# Altium schematic sheet TMS320F28379D_TRIP.SchDoc
size A4
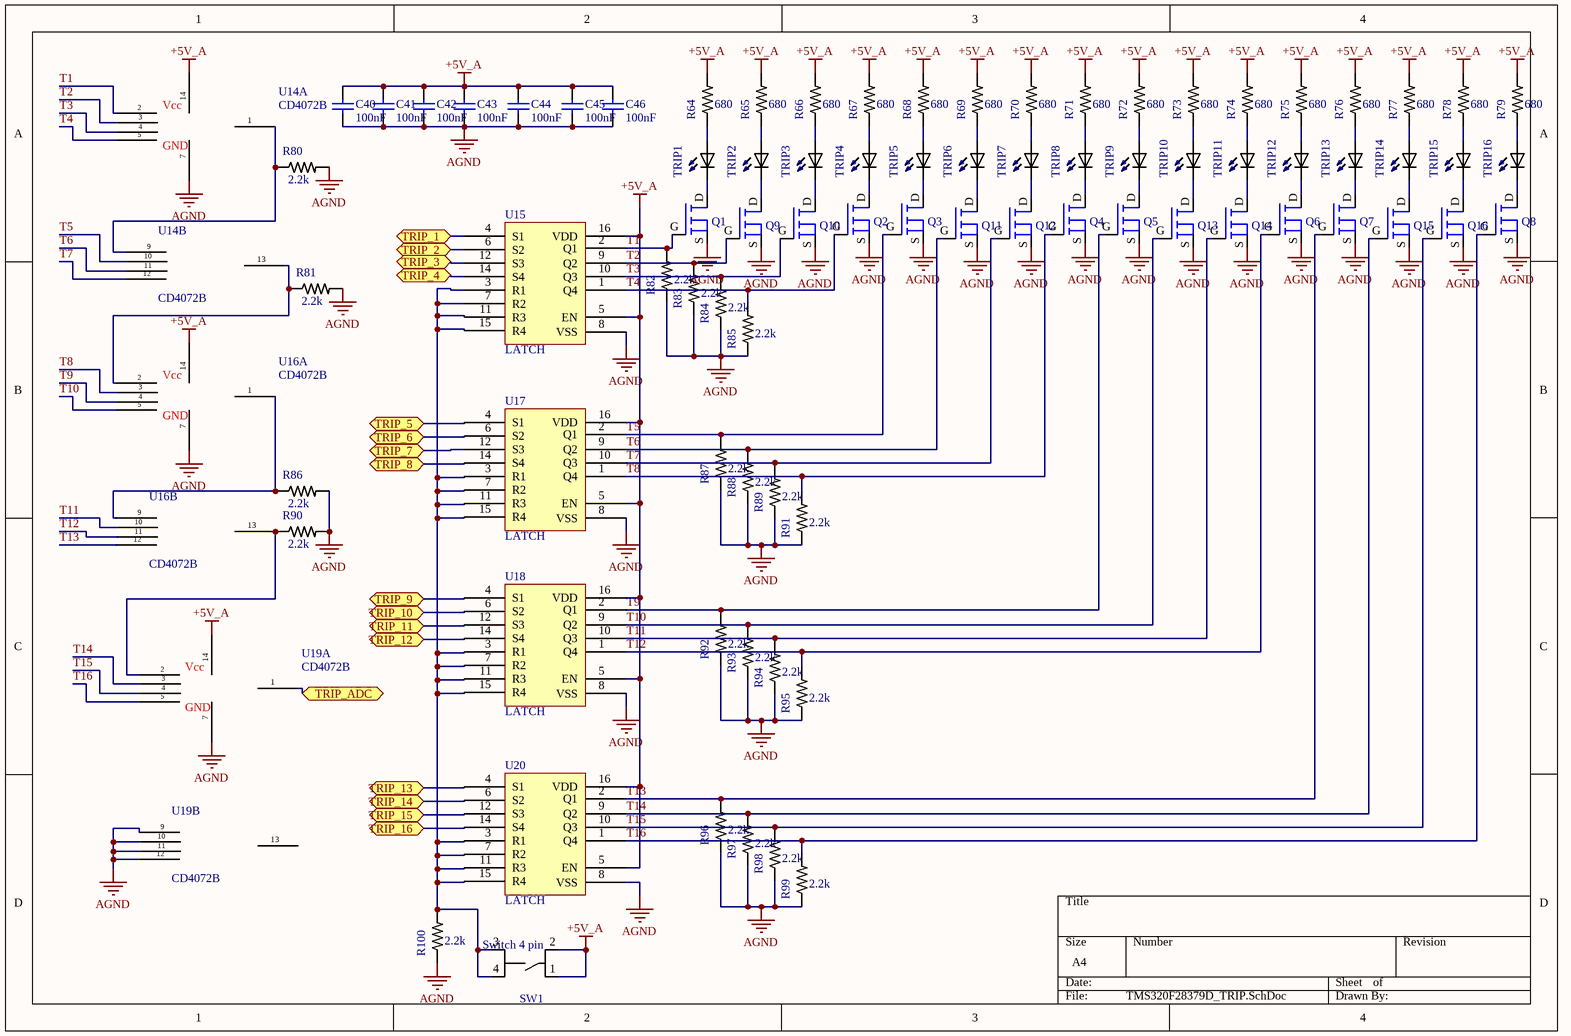
[diagram p0: TMS320F28379D_TRIP.SchDoc]

## Parts
C40  value 100nF  [CAP 0805]  (hidden comment: Cap cerámico)
C41  value 100nF  [CAP 0805]  (hidden comment: Cap cerámico)
C42  value 100nF  [CAP 0805]  (hidden comment: Cap cerámico)
C43  value 100nF  [CAP 0805]  (hidden comment: Cap cerámico)
C44  value 100nF  [CAP 0805]  (hidden comment: Cap cerámico)
C45  value 100nF  [CAP 0805]  (hidden comment: Cap cerámico)
C46  value 100nF  [CAP 0805]  (hidden comment: Cap cerámico)
Q1  MOSFET N  [SOT23]  (value not drawn)
Q2  MOSFET N  [SOT23]  (value not drawn)
Q3  MOSFET N  [SOT23]  (value not drawn)
Q4  MOSFET N  [SOT23]  (value not drawn)
Q5  MOSFET N  [SOT23]  (value not drawn)
Q6  MOSFET N  [SOT23]  (value not drawn)
Q7  MOSFET N  [SOT23]  (value not drawn)
Q8  MOSFET N  [SOT23]  (value not drawn)
Q9  MOSFET N  [SOT23]  (value not drawn)
Q10  MOSFET N  [SOT23]  (value not drawn)
Q11  MOSFET N  [SOT23]  (value not drawn)
Q12  MOSFET N  [SOT23]  (value not drawn)
Q13  MOSFET N  [SOT23]  (value not drawn)
Q14  MOSFET N  [SOT23]  (value not drawn)
Q15  MOSFET N  [SOT23]  (value not drawn)
Q16  MOSFET N  [SOT23]  (value not drawn)
R64  value 680  [Resistor 0805]  (hidden comment: Resistor 0805)
R65  value 680  [Resistor 0805]  (hidden comment: Resistor 0805)
R66  value 680  [Resistor 0805]  (hidden comment: Resistor 0805)
R67  value 680  [Resistor 0805]  (hidden comment: Resistor 0805)
R68  value 680  [Resistor 0805]  (hidden comment: Resistor 0805)
R69  value 680  [Resistor 0805]  (hidden comment: Resistor 0805)
R70  value 680  [Resistor 0805]  (hidden comment: Resistor 0805)
R71  value 680  [Resistor 0805]  (hidden comment: Resistor 0805)
R72  value 680  [Resistor 0805]  (hidden comment: Resistor 0805)
R73  value 680  [Resistor 0805]  (hidden comment: Resistor 0805)
R74  value 680  [Resistor 0805]  (hidden comment: Resistor 0805)
R75  value 680  [Resistor 0805]  (hidden comment: Resistor 0805)
R76  value 680  [Resistor 0805]  (hidden comment: Resistor 0805)
R77  value 680  [Resistor 0805]  (hidden comment: Resistor 0805)
R78  value 680  [Resistor 0805]  (hidden comment: Resistor 0805)
R79  value 680  [Resistor 0805]  (hidden comment: Resistor 0805)
R80  value 2.2k  [Resistor 0805]  (hidden comment: Resistor 0805)
R81  value 2.2k  [Resistor 0805]  (hidden comment: Resistor 0805)
R82  value 2.2k  [Resistor 0805]  (hidden comment: Resistor 0805)
R83  value 2.2k  [Resistor 0805]  (hidden comment: Resistor 0805)
R84  value 2.2k  [Resistor 0805]  (hidden comment: Resistor 0805)
R85  value 2.2k  [Resistor 0805]  (hidden comment: Resistor 0805)
R86  value 2.2k  [Resistor 0805]  (hidden comment: Resistor 0805)
R87  value 2.2k  [Resistor 0805]  (hidden comment: Resistor 0805)
R88  value 2.2k  [Resistor 0805]  (hidden comment: Resistor 0805)
R89  value 2.2k  [Resistor 0805]  (hidden comment: Resistor 0805)
R90  value 2.2k  [Resistor 0805]  (hidden comment: Resistor 0805)
R91  value 2.2k  [Resistor 0805]  (hidden comment: Resistor 0805)
R92  value 2.2k  [Resistor 0805]  (hidden comment: Resistor 0805)
R93  value 2.2k  [Resistor 0805]  (hidden comment: Resistor 0805)
R94  value 2.2k  [Resistor 0805]  (hidden comment: Resistor 0805)
R95  value 2.2k  [Resistor 0805]  (hidden comment: Resistor 0805)
R96  value 2.2k  [Resistor 0805]  (hidden comment: Resistor 0805)
R97  value 2.2k  [Resistor 0805]  (hidden comment: Resistor 0805)
R98  value 2.2k  [Resistor 0805]  (hidden comment: Resistor 0805)
R99  value 2.2k  [Resistor 0805]  (hidden comment: Resistor 0805)
R100  value 2.2k  [Resistor 0805]  (hidden comment: Resistor 0805)
SW1  Switch 4 pin  [Switch 4 pin]
TRIP1  LED  [LED_0805]  (value not drawn)
TRIP2  LED  [LED_0805]  (value not drawn)
TRIP3  LED  [LED_0805]  (value not drawn)
TRIP4  LED  [LED_0805]  (value not drawn)
TRIP5  LED  [LED_0805]  (value not drawn)
TRIP6  LED  [LED_0805]  (value not drawn)
TRIP7  LED  [LED_0805]  (value not drawn)
TRIP8  LED  [LED_0805]  (value not drawn)
TRIP9  LED  [LED_0805]  (value not drawn)
TRIP10  LED  [LED_0805]  (value not drawn)
TRIP11  LED  [LED_0805]  (value not drawn)
TRIP12  LED  [LED_0805]  (value not drawn)
TRIP13  LED  [LED_0805]  (value not drawn)
TRIP14  LED  [LED_0805]  (value not drawn)
TRIP15  LED  [LED_0805]  (value not drawn)
TRIP16  LED  [LED_0805]  (value not drawn)
U14  CD4072B  [14-TSSOP]  (parts A,B of 2)
U15  LATCH  [16-SOIC]
U16  CD4072B  [14-TSSOP]  (parts A,B of 2)
U17  LATCH  [16-SOIC]
U18  LATCH  [16-SOIC]
U19  CD4072B  [14-TSSOP]  (parts A,B of 2)
U20  LATCH  [16-SOIC]

## Ports
TRIP_1, TRIP_2, TRIP_3, TRIP_4, TRIP_5, TRIP_6, TRIP_7, TRIP_8, TRIP_9, TRIP_10, TRIP_11, TRIP_12, TRIP_13, TRIP_14, TRIP_15, TRIP_16, TRIP_ADC

## Nets
+5V_A: C40.1 C41.1 C42.1 C43.1 C44.1 C45.1 C46.1 R64.2 R65.2 R66.2 R67.2 R68.2 R69.2 R70.2 R71.2 R72.2 R73.2 R74.2 R75.2 R76.2 R77.2 R78.2 R79.2 SW1.1 SW1.2 U14.14 U15.5(EN) U15.16(VDD) U16.14 U17.5(EN) U17.16(VDD) U18.5(EN) U18.16(VDD) U19.14 U20.5(EN) U20.16(VDD)
AGND: C40.2 C41.2 C42.2 C43.2 C44.2 C45.2 C46.2 Q1.S Q2.S Q3.S Q4.S Q5.S Q6.S Q7.S Q8.S Q9.S Q10.S Q11.S Q12.S Q13.S Q14.S Q15.S Q16.S R80.2 R81.2 R82.1 R83.1 R84.1 R85.1 R86.2 R87.1 R88.1 R89.1 R90.2 R91.1 R92.1 R93.1 R94.1 R95.1 R96.1 R97.1 R98.1 R99.1 R100.1 U14.7 U15.8(VSS) U16.7 U17.8(VSS) U18.8(VSS) U19.7 U19.9 U19.10 U19.11 U19.12 U20.8(VSS)
T1: Q1.G R82.2 U14.2 U15.2(Q1)
T2: Q9.G R83.2 U14.3 U15.9(Q2)
T3: Q10.G R84.2 U14.4 U15.10(Q3)
T4: Q2.G R85.2 U14.5 U15.1(Q4)
T5: Q3.G R87.2 U14.10 U17.2(Q1)
T6: Q11.G R88.2 U14.11 U17.9(Q2)
T7: Q12.G R89.2 U14.12 U17.10(Q3)
T8: Q4.G R91.2 U16.3 U17.1(Q4)
T9: Q5.G R92.2 U16.4 U18.2(Q1)
T10: Q13.G R93.2 U16.5 U18.9(Q2)
T11: Q14.G R94.2 U16.10 U18.10(Q3)
T12: Q6.G R95.2 U16.11 U18.1(Q4)
T13: Q7.G R96.2 U16.12 U20.2(Q1)
T14: Q15.G R97.2 U19.3 U20.9(Q2)
T15: Q16.G R98.2 U19.4 U20.10(Q3)
T16: Q8.G R99.2 U19.5 U20.1(Q4)
TRIP_1: U15.4(S1) ; port TRIP_1
TRIP_2: U15.6(S2) ; port TRIP_2
TRIP_3: U15.12(S3) ; port TRIP_3
TRIP_4: U15.14(S4) ; port TRIP_4
TRIP_5: U17.4(S1) ; port TRIP_5
TRIP_6: U17.6(S2) ; port TRIP_6
TRIP_7: U17.12(S3) ; port TRIP_7
TRIP_8: U17.14(S4) ; port TRIP_8
TRIP_9: U18.4(S1) ; port TRIP_9
TRIP_10: U18.6(S2) ; port TRIP_10
TRIP_11: U18.12(S3) ; port TRIP_11
TRIP_12: U18.14(S4) ; port TRIP_12
TRIP_13: U20.4(S1) ; port TRIP_13
TRIP_14: U20.6(S2) ; port TRIP_14
TRIP_15: U20.12(S3) ; port TRIP_15
TRIP_16: U20.14(S4) ; port TRIP_16
TRIP_ADC: U19.1 ; port TRIP_ADC
NetQ1_D: Q1.D TRIP1.1(NEG)
NetQ2_D: Q2.D TRIP4.1(NEG)
NetQ3_D: Q3.D TRIP5.1(NEG)
NetQ4_D: Q4.D TRIP8.1(NEG)
NetQ5_D: Q5.D TRIP9.1(NEG)
NetQ6_D: Q6.D TRIP12.1(NEG)
NetQ7_D: Q7.D TRIP13.1(NEG)
NetQ8_D: Q8.D TRIP16.1(NEG)
NetQ9_D: Q9.D TRIP2.1(NEG)
NetQ10_D: Q10.D TRIP3.1(NEG)
NetQ11_D: Q11.D TRIP6.1(NEG)
NetQ12_D: Q12.D TRIP7.1(NEG)
NetQ13_D: Q13.D TRIP10.1(NEG)
NetQ14_D: Q14.D TRIP11.1(NEG)
NetQ15_D: Q15.D TRIP14.1(NEG)
NetQ16_D: Q16.D TRIP15.1(NEG)
NetR64_1: R64.1 TRIP1.2(POS)
NetR65_1: R65.1 TRIP2.2(POS)
NetR66_1: R66.1 TRIP3.2(POS)
NetR67_1: R67.1 TRIP4.2(POS)
NetR68_1: R68.1 TRIP5.2(POS)
NetR69_1: R69.1 TRIP6.2(POS)
NetR70_1: R70.1 TRIP7.2(POS)
NetR71_1: R71.1 TRIP8.2(POS)
NetR72_1: R72.1 TRIP9.2(POS)
NetR73_1: R73.1 TRIP10.2(POS)
NetR74_1: R74.1 TRIP11.2(POS)
NetR75_1: R75.1 TRIP12.2(POS)
NetR76_1: R76.1 TRIP13.2(POS)
NetR77_1: R77.1 TRIP14.2(POS)
NetR78_1: R78.1 TRIP15.2(POS)
NetR79_1: R79.1 TRIP16.2(POS)
NetR80_1: R80.1 U14.1 U14.9
NetR81_1: R81.1 U14.13 U16.2
NetR86_1: R86.1 U16.1 U16.9
NetR90_1: R90.1 U16.13 U19.2
NetR100_2: R100.2 SW1.3 SW1.4 U15.3(R1) U15.7(R2) U15.11(R3) U15.15(R4) U17.3(R1) U17.7(R2) U17.11(R3) U17.15(R4) U18.3(R1) U18.7(R2) U18.11(R3) U18.15(R4) U20.3(R1) U20.7(R2) U20.11(R3) U20.15(R4)

Not connected (* = marked no-connect by the designer): U19 13

## Notes on the sheet
- (in symbol CD4072B, part A) Vcc; GND

## Library data of the parts
Q1-Q16 = MOSFET_N: 2N7002-FDICT-ND; Manufacturer Part Number: 2N7002-7-F; Código de producto RS: 708-2396; Digi-Key Part Number: 2N7002-FDICT-ND
R64-R100 = Resistor: Digi-Key Part Number: *; Manufacturer Part Number: *
SW1 = Switch 4 pin: Manufacturer Part Number: PTS645SM43-2 LFS; Código de producto RS: 135-9534; Digi-Key Part Number: CKN10899-ND
TRIP1-TRIP16 = LED: Manufacturer Part Number: 150080RS75000; Código de producto RS: 815-4225; Digi-Key Part Number: 732-4984-1-ND
U14 U16 U19 = CD4072B: 2 OR GATE 4 INPUT; Manufacturer Part Number: CD4072BPW; Código de producto RS: 809-5517; Digi-Key Part Number: 296-32907-5-ND
U15 U17 U18 U20 = HEF4043: IC R/S LATCH 3-STATE QUAD 16SOIC; Manufacturer Part Number: HEF4043BT,653; Código de producto RS: 168-9605; Digi-Key Part Number: 1727-1799-1-ND
C40-C46 = Cap cerámico: Digi-Key Part Number: *; Manufacturer Part Number: *